# Altium schematic sheet 3.SchDoc
size A4; SheetNumber: 3; SheetTotal: 5
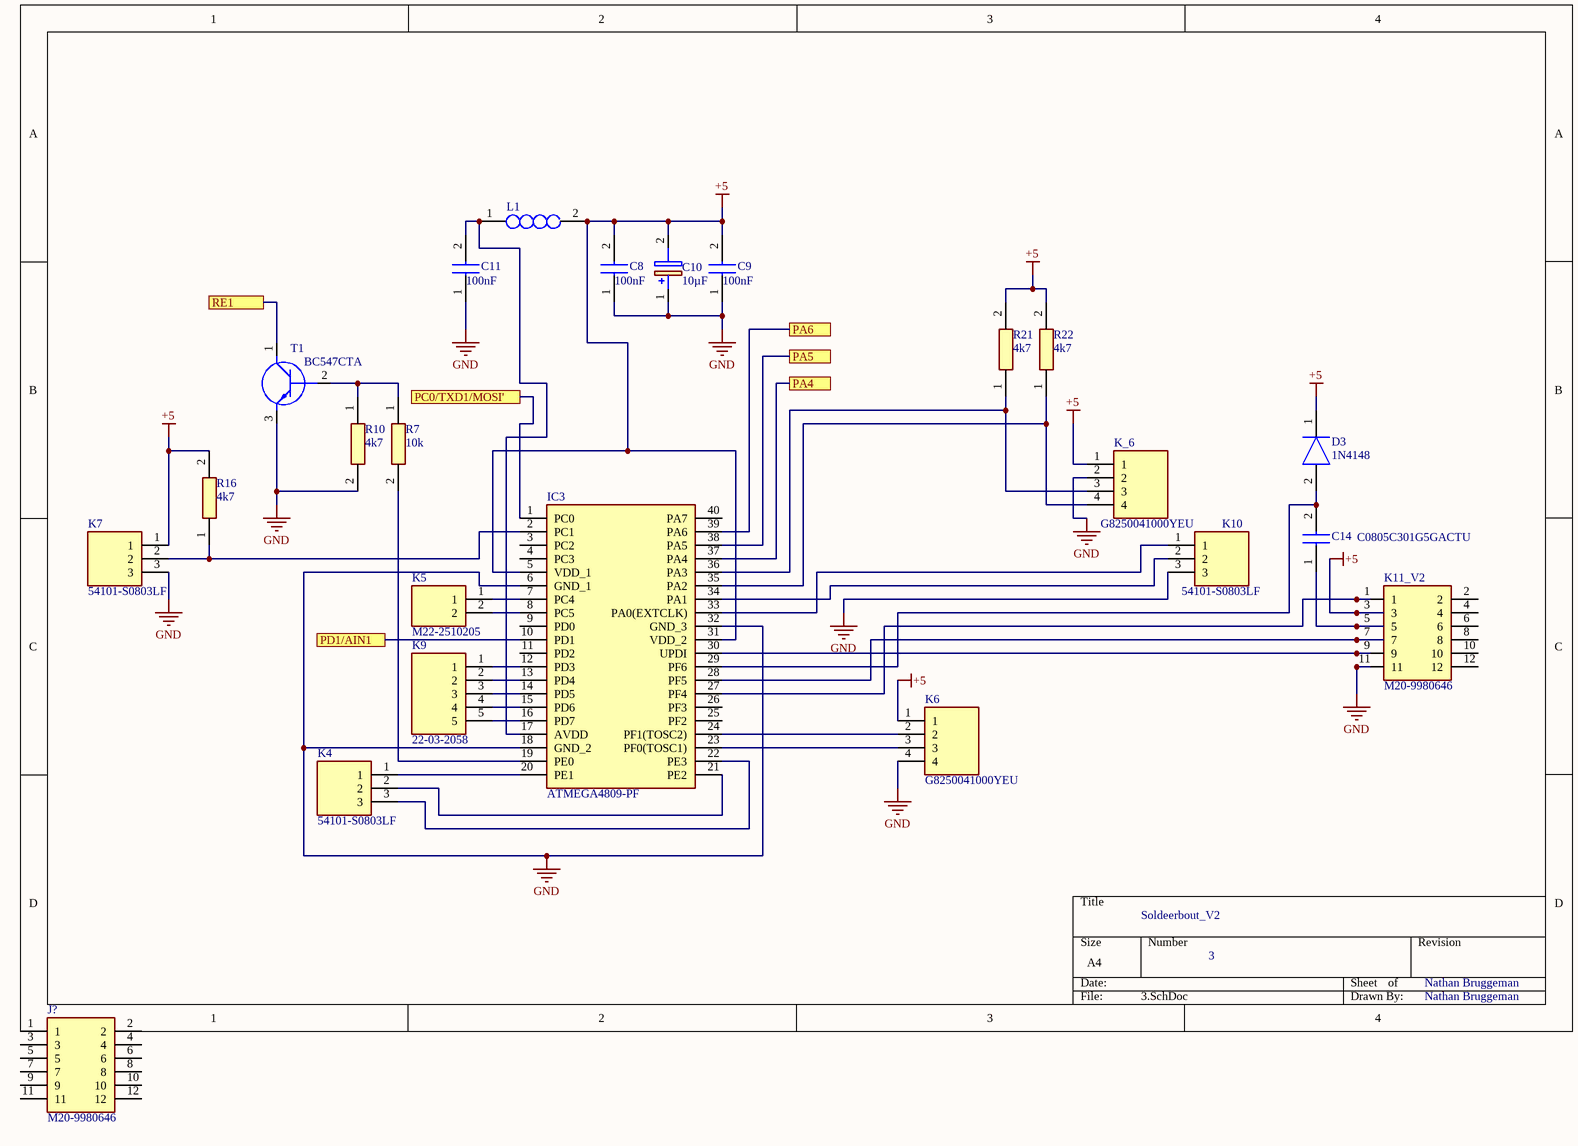
[diagram p0: 3.SchDoc]

## Parts
C8  100nF  [0805]
C9  100nF  [0805]
C10  10µF  [CAPPRD200W55D500H1200]
C11  100nF  [0805]
C14  C0805C301G5GACTU  [0805]
D3  1N4148  [DIOAD1165W56L425D185]
IC3  ATMEGA4809-PF  [DIP1543W58P254L5175H635Q40N]
J?  M20-9980646  [HDRV12W64P254_2X6_1524X508X868P]
K4  54101-S0803LF  [54101S0803LF]
K5  M22-2510205  [HDRV2W60P0X200_1X2_400X200X525P]
K6  G8250041000YEU  [G8250041000YEU]
K7  54101-S0803LF  [54101S0803LF]
K9  22-03-2058  [HDRV5W67P0X254_1X5_1245X236X2068P]
K10  54101-S0803LF  [54101S0803LF]
K11_V2  M20-9980646  [HDRV12W64P254_2X6_1524X508X868P]
K_6  G8250041000YEU  [G8250041000YEU]
L1  LS6045EX-100M-H  [VLS6045]  (value not drawn)
R7  10k  [0805]
R10  4k7  [0805]
R16  4k7  [0805]
R21  4k7  [0805]
R22  4k7  [0805]
T1  BC547CTA  [BC557C]

## Ports
PA4, PA5, PA6, PC0/TXD1/MOSI', PD1/AIN1, RE1

## Nets
+5: C8.2 C9.2 C10.2(-) D3.1(K) IC3.5(VDD_1) IC3.31(VDD_2) K6.1 K7.1 K11_V2.3 K_6.1 L1.2 R16.2 R21.2 R22.2
GND: C8.1 C9.1 C10.1(+) C11.1 IC3.6(GND_1) IC3.18(GND_2) IC3.32(GND_3) K6.4 K7.3 K10.3 K11_V2.11 K_6.2 R10.2 T1.3(E)
PA4: IC3.37(PA4) ; port PA4
PA5: IC3.38(PA5) ; port PA5
PA6: IC3.39(PA6) ; port PA6
PC0/TXD1/MOSI': IC3.1(PC0) ; port PC0/TXD1/MOSI'
PD1/AIN1: IC3.10(PD1) ; port PD1/AIN1
RE1: T1.1(C) ; port RE1
NetC11_2: C11.2 IC3.17(AVDD) L1.1
NetC14_1: C14.1 K11_V2.5
NetC14_2: C14.2 D3.2(A) IC3.29(PF6)
NetIC3_2: IC3.2(PC1) K7.2 R16.1
NetIC3_7: IC3.7(PC4) K5.1
NetIC3_8: IC3.8(PC5) K5.2
NetIC3_12: IC3.12(PD3) K9.1
NetIC3_13: IC3.13(PD4) K9.2
NetIC3_14: IC3.14(PD5) K9.3
NetIC3_15: IC3.15(PD6) K9.4
NetIC3_16: IC3.16(PD7) K9.5
NetIC3_19: IC3.19(PE0) R7.2
NetIC3_20: IC3.20(PE1) K4.1
NetIC3_21: IC3.21(PE2) K4.2
NetIC3_22: IC3.22(PE3) K4.3
NetIC3_23: IC3.23(PF0(TOSC1)) K6.3
NetIC3_24: IC3.24(PF1(TOSC2)) K6.2
NetIC3_27: IC3.27(PF4) K11_V2.1
NetIC3_28: IC3.28(PF5) K11_V2.7
NetIC3_30: IC3.30(UPDI) K11_V2.9
NetIC3_33: IC3.33(PA0(EXTCLK)) K10.1
NetIC3_34: IC3.34(PA1) K10.2
NetIC3_35: IC3.35(PA2) K_6.4 R22.1
NetIC3_36: IC3.36(PA3) K_6.3 R21.1
NetR7_1: R7.1 R10.1 T1.2(B)

Not connected (* = marked no-connect by the designer): IC3 3(PC2) 4(PC3) 9(PD0) 11(PD2) 25(PF2) 26(PF3) 40(PA7); J? 1 2 3 4 5 6 7 8 9 10 11 12; K11_V2 2 4 6 8 10 12

## Notes on the sheet
- Soldeerbout_V2
- 3
- Nathan Bruggeman

## Library data of the parts
C8 C9 C11 C14 = C0805C301G5GACTU: Capacitor; Manufacturer_Name: Kemet; Datasheet Link: https://connect.kemet.com:7667/gateway/IntelliData-ComponentDocumentation/1.0/download/specsheet/C0805C301G5GACTU; Height: 0.88mm; Manufacturer_Part_Number: C0805C301G5GACTU
C10 = ECA-1HM100: Capacitor Polarised; Manufacturer_Name: Panasonic; Datasheet Link: https://componentsearchengine.com//ECA-1HM100.pdf; Height: 12mm; Mouser2 Part Number: 667-ECA-1HM100; Mouser2 Price/Stock: https://www.mouser.com/Search/Refine.aspx?Keyword=667-ECA-1HM100; Manufacturer_Part_Number: ECA-1HM100
D3 = 1N4148: Diode; Manufacturer_Name: Nexperia; Datasheet Link: https://datasheet.datasheetarchive.com/originals/distributors/Datasheets-112/DSAP0040891.pdf; Manufacturer_Part_Number: 1N4148
IC3 = ATMEGA4809-PF: Integrated Circuit; Manufacturer_Name: Microchip; Datasheet Link: https://componentsearchengine.com//ATMEGA4809-PF.pdf; Height: 6.35mm; Mouser2 Part Number: 556-ATMEGA4809-PF; Mouser2 Price/Stock: https://www.mouser.com/Search/Refine.aspx?Keyword=556-ATMEGA4809-PF; Manufacturer_Part_Number: ATMEGA4809-PF
J? = M20-9980646: Connector; Manufacturer_Name: Harwin; Height: 8.68mm; Manufacturer_Part_Number: M20-9980646
K4 K7 K10 = 54101-S0803LF: Connector; Manufacturer_Name: Amphenol; Datasheet Link: https://cdn.amphenol-icc.com/media/wysiwyg/files/drawing/54101.pdf; Height: 8.58mm; Manufacturer_Part_Number: 54101-S0803LF
K5 = M22-2510205: Connector; Manufacturer_Name: Harwin; Datasheet Link: https://cdn.harwin.com/pdfs/M22-251.pdf; Height: 5.25mm; Manufacturer_Part_Number: M22-2510205
K6 K_6 = G8250041000YEU: Connector; Manufacturer_Name: Amphenol; Datasheet Link: https://cdn.amphenol-icc.com/media/wysiwyg/files/drawing/g825xxx10x0yeu.pdf; Height: 6.35mm; Manufacturer_Part_Number: G8250041000YEU
K9 = 22-03-2058: Capacitor; Manufacturer_Name: Molex; Height: 20.68mm; Manufacturer_Part_Number: 22-03-2058
K11_V2 = M20-9980646: Connector; Manufacturer_Name: Harwin; Description: 06+06 DIL Vertical Pin Header HARWIN M20 Series; Height: 8.68mm; Manufacturer_Part_Number: M20-9980646
L1 = VLS6045EX-100M-H: Inductor; Manufacturer_Name: TDK; Datasheet Link: https://componentsearchengine.com//VLS6045EX-100M-H.pdf; Mouser2 Part Number: 810-VLS6045EX-100M-H; Mouser2 Price/Stock: https://www.mouser.com/Search/Refine.aspx?Keyword=810-VLS6045EX-100M-H; Manufacturer_Part_Number: VLS6045EX-100M-H
R7 R10 R16 R21 R22 = CFN0805-FZ-R030ELF: Resistor; Manufacturer_Name: Bourns; Datasheet Link: https://www.bourns.com/docs/Product-Datasheets/CFN.pdf; Height: 0.9mm; Manufacturer_Part_Number: CFN0805-FZ-R030ELF
T1 = BC547CTA: Transistor BJT NPN; Manufacturer_Name: ON Semiconductor; Datasheet Link: http://www.onsemi.com/pub/Collateral/BC550-D.pdf; Manufacturer_Part_Number: BC547CTA